# Altium schematic sheet MCU021_V1.0_Hardware.SchDoc: Labels, Mechanical Hardware, Shunts, Misc.
size A3; Date: Not shown in title block; ApprovedBy: Not shown in title block; CheckedBy: Not shown in title block; Author: Not shown in title block; CompanyName: Not shown in title block; Engineer: Not shown in title block; Organization: Not shown in title block; Address1: Not shown in title block; Address2: Not shown in title block; Address3: Not shown in title block; Address4: Not shown in title block; DocumentNumber: 5; Revision: Use project parameter SCH_Rev; SheetNumber: 5; SheetTotal: 5; PageSetup: Record=PageOptions|CenterHorizontal=True|CenterVertical=True|PrintScale=1.00|XCorrection=1.00|YCorrection=1.00|PrintKind=0|BorderSize=5000000|LeftOffset=0|BottomOffset=0|Orientation=2|PaperLength=1000|PaperWidth=1000|Scale=100|PaperSource=15|PrintQuality=600|MediaType=1|DitherType=10|PaperKind=Letter|PrintScaleMode=1; CurrentTime: Not shown in title block; CurrentDate: Not shown in title block; Time: Not shown in title block; DocumentFullPathAndName: Not shown in title block; DocumentName: Not shown in title block; ModifiedDate: Not shown in title block; ImagePath: Not shown in title block
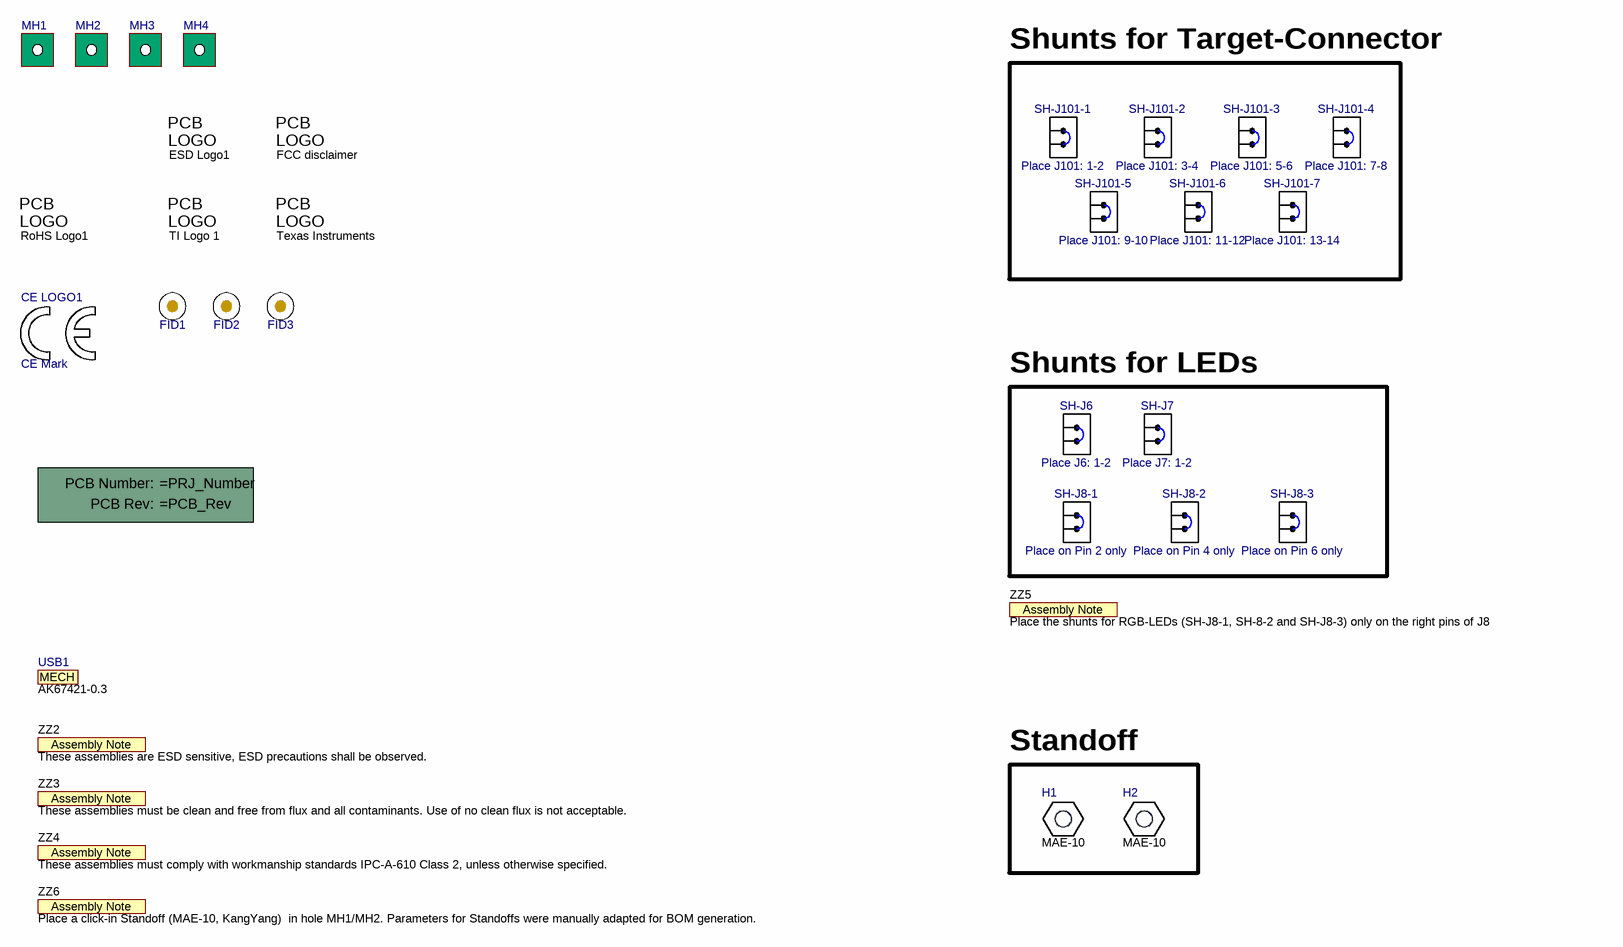
[diagram p0: MCU021_V1.0_Hardware.SchDoc]

## Parts
!PCB  Printed Circuit Board  (value not drawn)  (mechanical)
CE_LOGO1  CE Mark  [CE_Mark_5mm]  (no BOM)
ESD_Logo1  ESD Susceptible  [ESD_Overlay_Medium]  (value not drawn)  (no BOM)
FID1  Fiducial  [Fiducial6.4-20]  (value not drawn)
FID2  Fiducial  [Fiducial6.4-20]  (value not drawn)
FID3  Fiducial  [Fiducial6.4-20]  (value not drawn)
H1  MAE-10  [KY_MAE-10]
H2  MAE-10  [KY_MAE-10]
Logo1  Texas Instruments  [TI_Symbol_Overlay_Medium]  (no BOM)
Logo3  FCC disclaimer  [FCC_disclaimer]  (no BOM)
MH1  MTG_NoPads  [NPTH125mil]  (value not drawn)  (no BOM)
MH2  MTG_NoPads  [NPTH125mil]  (value not drawn)  (no BOM)
MH3  MTG_NoPads  [NPTH125mil]  (value not drawn)  (no BOM)
MH4  MTG_NoPads  [NPTH125mil]  (value not drawn)  (no BOM)
RoHS_Logo1  Pb-Free Symbol  [Pb-Free_Overlay_Medium]  (value not drawn)  (no BOM)
SH-J6  Place J6: 1-2  [SNT-100-BK-G]
SH-J7  Place J7: 1-2  [SNT-100-BK-G]
SH-J8-1  Place on Pin 2 only  [SNT-100-BK-G]
SH-J8-2  Place on Pin 4 only  [SNT-100-BK-G]
SH-J8-3  Place on Pin 6 only  [SNT-100-BK-G]
SH-J101-1  Place J101: 1-2  [SNT-100-BK-G]
SH-J101-2  Place J101: 3-4  [SNT-100-BK-G]
SH-J101-3  Place J101: 5-6  [SNT-100-BK-G]
SH-J101-4  Place J101: 7-8  [SNT-100-BK-G]
SH-J101-5  Place J101: 9-10  [SNT-100-BK-G]
SH-J101-6  Place J101: 11-12  [SNT-100-BK-G]
SH-J101-7  Place J101: 13-14  [SNT-100-BK-G]
TI_Logo_1  Texas Instruments  [TI_Horizontal_Overlay_Medium]  (value not drawn)  (no BOM)
USB1  AK67421-0.3  (mechanical)
ZZ2  These assemblies are ESD sensitive, ESD precautions shall be observed.  [AssemblyNote]  (no BOM)
ZZ3  These assemblies must be clean and free from flux and all contaminants. Use of no clean flux is not acceptable.  [AssemblyNote]  (no BOM)
ZZ4  These assemblies must comply with workmanship standards IPC-A-610 Class 2, unless otherwise specified.  [AssemblyNote]  (no BOM)
ZZ5  Place the shunts for RGB-LEDs (SH-J8-1, SH-8-2 and SH-J8-3) only on the right pins of J8  [AssemblyNote]  (no BOM)
ZZ6  Place a click-in Standoff (MAE-10, KangYang)  in hole MH1/MH2. Parameters for Standoffs were manually adapted for BOM generation.  [AssemblyNote]  (no BOM)

## Blocks framed on the sheet
Shunts for Target-Connector: SH-J101-1-SH-J101-7
Shunts for LEDs: SH-J6 SH-J7 SH-J8-1-SH-J8-3
Standoff: H1 H2

## Notes on the sheet
- Drawn By:
- SVN Rev:
- Number:
- TID #:
- Orderable:
- Rev:
- Sheet Title:
- File:
- Project Title:
- Designed for:
- Assembly Variant:
- Mod. Date:
- Sheet:
- Size:
- of
- A3
- http://www.ti.com
- Texas Instruments and/or its licensors do not warrant the accuracy or completeness of this specification or any information contained therein. Texas Instruments and/or its licensors do not warrant that this design will meet the specifications, will be suitable for your application or fit for any particular purpose, or will operate in an implementation. Texas Instruments and/or its licensors do not warrant that the design is production worthy. You should completely validate and test your design implementation to confirm the system functionality for your application.
- Engineer:
- Contact:
- © Texas Instruments
- (in symbol AssemblyNote) Assembly Note
- (in symbol CMP-0077983-1) MECH
- (in symbol ESD_Susceptible) PCB; LOGO
- (in symbol FCC_disclaimer) PCB; LOGO
- (in symbol Pb-Free) PCB; LOGO
- (in symbol PCB) PCB Number:; PCB Rev:
- (in symbol TI_Logo) PCB; LOGO

## Library data of the parts
!PCB = PCB: Manufacturer: Any; SymbolCreator: a0412235; SymbolVersion: 2012-05-30; CompType: PCB; PartNumber: =PRJ_Number; RoHS: O; MountType: N/A; Publisher: Texas Instruments; LatestRevisionDate: 2012-06-27; LatestRevisionNote: Initial Version; Alternate Manufacturer: -; Alternate PartNumber: -
CE_LOGO1 = CMP-0074844-1: SymbolCreator: a0412235; Publisher: Texas Instruments; Library Reference: CE Mark; Lib Reference: CE Mark; LatestRevisionDate: 2017-07-06; PartNumber: CE Mark; Published: 2009-03-03
ESD_Logo1 = ESD_Susceptible: ESD Susceptible Symbol; SymbolCreator: a0412235; SymbolVersion: 2011-08-22; Published: 2009-03-03; Publisher: Texas Instruments; LatestRevisionDate: 2016-03-21
FID1-FID3 = Fiducial: Fiducial mark.  There is nothing to buy or mount.; SymbolCreator: codlsc; SymbolVersion: 2009-11-4; CompType: Fiducial; PackageReference: N/A; ClassName: FiducialMark; Manufacturer: N/A; PartNumber: N/A; MountType: N/A; Publisher: Texas Instruments; LatestRevisionDate: 2017-05-31; LatestRevisionNote: Added Alternate PartNumber and Alternate Manufacturer parameters to appropriate components.
H1 H2 = CMP-0077978-1: Spacer Support, Nylon 66; Manufacturer: Kang Yang; CompType: Standoff; PartNumber: MAE-10; Key: MAE-10; PackageReference: Spacer Nylon Support; ComponentLink1Description: Datasheet Link; MountType: N/A; ComponentLink1URL: https://sps16.itg.ti.com/sites/KMS/crossdivteams/altium/docs/ComponentDatasheets/1104004000018---MAE-10.pdf; RoHS: Y
Logo1 = TI_Logo: Texas Instrument Corporate Signature; SymbolCreator: codlsc; SymbolVersion: 2011-08-22; Published: 2009-03-03; Publisher: National Semiconductor; ClassName: Logo; LatestRevisionDate: 2011-10-25; LatestRevisionNote: Added ClassName of Logo.
Logo3 = FCC_disclaimer: SymbolCreator: codlsc; SymbolVersion: 2011-08-22; Published: 2009-03-03; Publisher: Texas Instruments; LatestRevisionDate: 2014-11-20
MH1-MH4 = Mounting Hole (non-standard) No Pad: PCB Mounting Hole, No Pad; Manufacturer: Any; SymbolCreator: a0412235; SymbolVersion: 2013-12-26; ClassName: Mounting Holes; CompType: Mounting Hole; PartNumber: N/A; PackageReference: Mounting Hole; MountType: N/A; Publisher: Texas Instruments; LatestRevisionDate: 2017-06-01
RoHS_Logo1 = Pb-Free: SymbolCreator: a0412235; SymbolVersion: 2011-08-22; Published: 2009-03-03; Publisher: Texas Instruments; LatestRevisionDate: 2016-03-21
SH-J6 SH-J7 SH-J8-1-SH-J8-3 SH-J101-1-SH-J101-7 = SNT-100-BK-G: Shunt, 100mil, Gold plated, Black; Manufacturer: Samtec; Alternate Manufacturer: 3M; Alternate PartNumber: 969102-0000-DA; Value: 1x2; Note: You can "mate" this to a header by matching the designator.  i.e. use SH-J3 for header J3; Green_Lifecycle: Active; Green_REACh: Passed; ClassName: Shunt; CompType: Shunt; PartNumber: SNT-100-BK-G; RoHS: Y; PackageReference: Shunt; MountType: N/A; ComponentLink1Description: Datasheet Link; ComponentLink1URL: http://www.samtec.com/ftppub/pdf/SNT.PDF; Publisher: Texas Instruments; LatestRevisionDate: 2017-05-23; Supplier 1: Digi-Key; Supplier Part Number 1: SNT-100-BK-G-ND; Green_EU RoHS: Passed; Green_EU RoHS-2: Passed
  SH-J6: Assembly: Place J6: 1-2
  SH-J7: Assembly: Place J7: 1-2
  SH-J8-1: Assembly: Place on Pin 2 only
  SH-J8-2: Assembly: Place on Pin 4 only
  SH-J8-3: Assembly: Place on Pin 6 only
  SH-J101-1: Assembly: Place J101: 1-2
  SH-J101-2: Assembly: Place J101: 3-4
  SH-J101-3: Assembly: Place J101: 5-6
  SH-J101-4: Assembly: Place J101: 7-8
  SH-J101-5: Assembly: Place J101: 9-10
  SH-J101-6: Assembly: Place J101: 11-12
  SH-J101-7: Assembly: Place J101: 13-14
TI_Logo_1 = TI_Logo: Texas Instrument Corporate Signature; SymbolCreator: a0412235; SymbolVersion: 2011-08-22; ClassName: Logo; Published: 2009-03-03; Publisher: Texas Instruments; LatestRevisionDate: 2016-03-21
USB1 = CMP-0077983-1: Cable, USB-A to micro USB-B, 0.3 m; Manufacturer: Assman WSW; ComponentLink1URL: http://www.assmann-wsw.com/fileadmin/datasheets/ASS_7091_CA.pdf; Key: AK67421-0.3; CompType: Cable; Supplier 1: Digi-Key; RoHS: Y; Supplier Part Number 1: AE11229-ND; PartNumber: AK67421-0.3; MountType: N/A; ComponentLink1Description: Datasheet Link
ZZ2-ZZ6 = AssemblyNote: SymbolCreator: codlsc; SymbolVersion: 2010-05-18; CompType: AssemblyNote; ClassName: AssemblyNote; Publisher: Texas Instruments; LatestRevisionDate: 2012-06-14; LatestRevisionNote: Initial Version; Alternate Manufacturer: -; Alternate PartNumber: -